# Altium schematic sheet Final Schematic.SchDoc
size A4; SheetNumber: 1; SheetTotal: 1
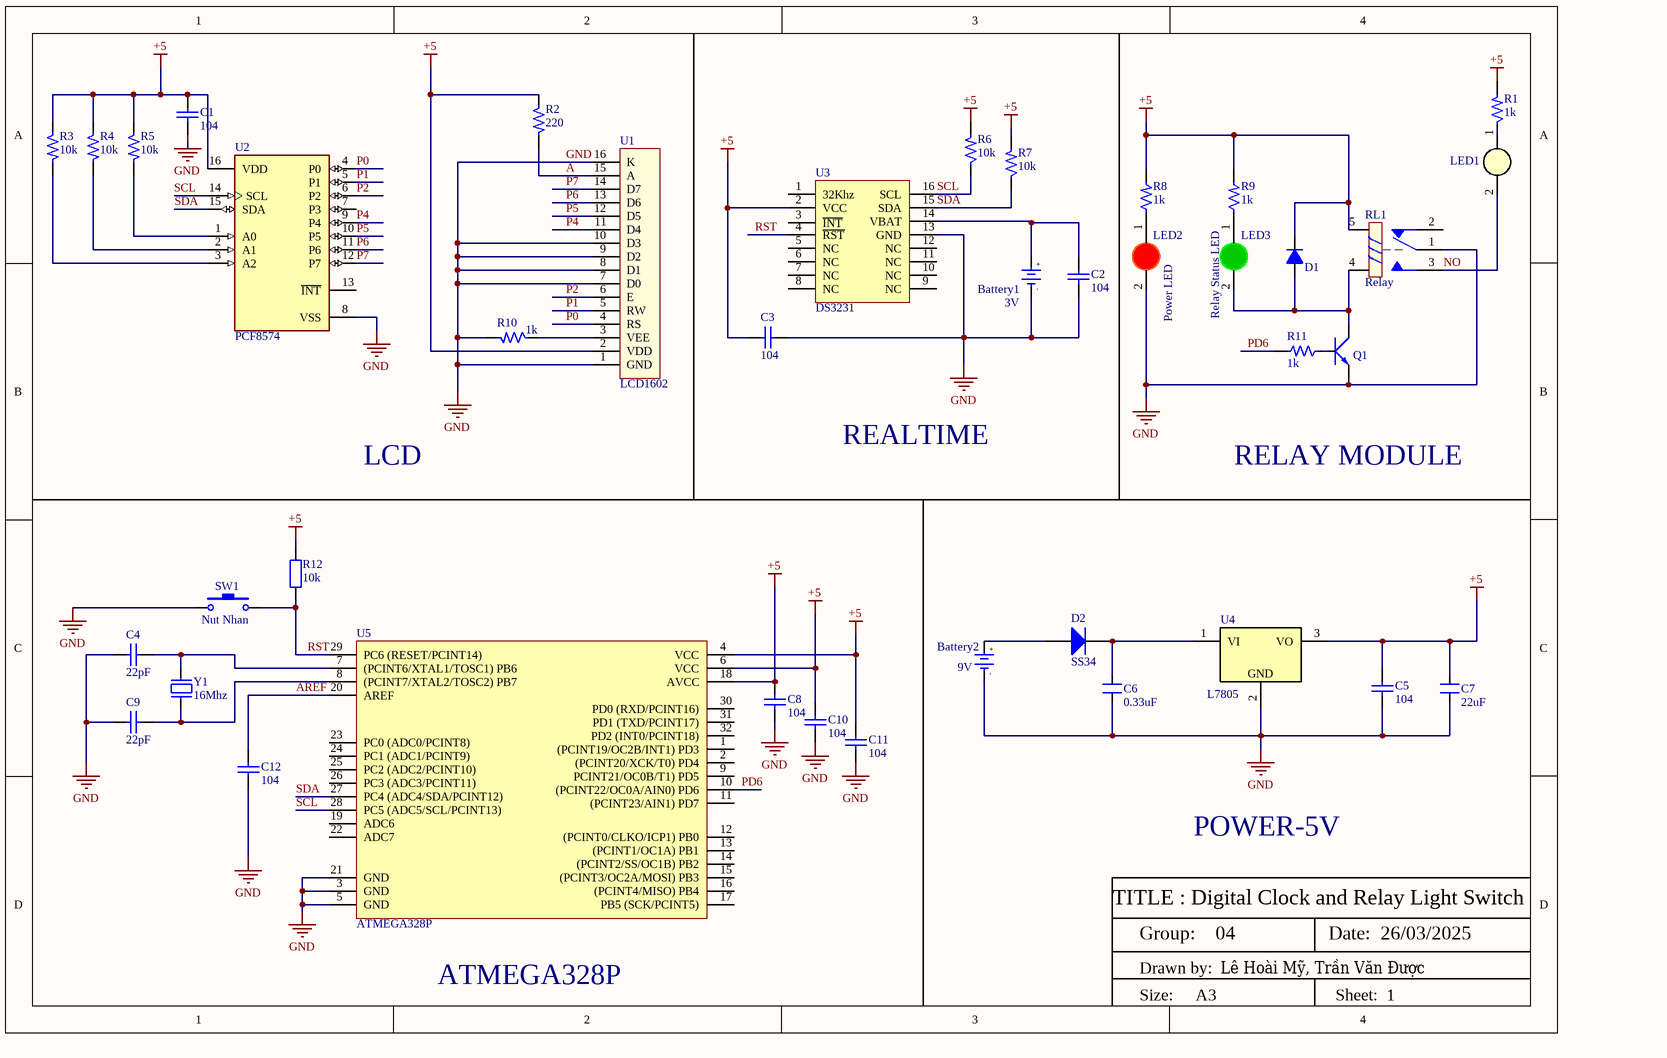
[diagram p0: Final Schematic.SchDoc]

## Parts
Battery1  3V  [PIN 3.6V 20mAh 3/V20H]
Battery2  9V  [De Pin 9V]
C1  104  [tu gom]
C2  104  [tu gom]
C3  104  [tu gom]
C4  22pF  [tu gom]
C5  104  [tu gom]
C6  0.33uF  [CN1]
C7  22uF  [CN1]
C8  104  [tu gom]
C9  22pF  [tu gom]
C10  104  [tu gom]
C11  104  [tu gom]
C12  104  [tu gom]
D1  100v  [DIODE 1A]  (value not drawn)
D2  SS34  [DIODE SMA]
LED1  LED 3mm  [LED-3MM-WHITE]  (value not drawn)
LED2  Power LED  [LED-3MM-RED]
LED3  Relay Status LED  [LED-3MM-GREEN]
Q1  ?  [TO92]  (value not drawn)
R1  1k  [R1/4W]
R2  220  [R1/4W]
R3  10k  [R1/4W]
R4  10k  [R1/4W]
R5  10k  [R1/4W]
R6  10k  [R1/4W]
R7  10k  [R1/4W]
R8  1k  [R1/4W]
R9  1k  [R1/4W]
R10  1k  [R1/4W]
R11  1k  [R1/4W]
R12  10k  [tro vach 1/4w]
RL1  Relay  [Relay 5 Chan SRD]
SW1  Nut Nhan  [Nut Nhan 2 Chan SMD 3x6x2.5]
U1  LCD1602  [LCD1602 with Jump]
U2  PCF8574  [FP-SOT162-1-MFG]
U3  DS3231  [SOIC 16]
U4  L7805  [DPAK_118_446_112X59_SMD]
U5  ATMEGA328P  [TQFP-32]
Y1  16Mhz  [Thach Anh 2 chan SMD]

## Nets
+5: C1.2 C3.2 C5.1 C7.2 C8.2 C10.2 C11.2 D1.2(K) R1.2 R2.1 R3.1 R4.1 R5.1 R6.2 R7.2 R8.2 R9.2 R12.2 RL1.5 U1.2(VDD) U2.16(VDD) U3.2(VCC) U4.3(VO) U5.4(VCC) U5.6(VCC) U5.18(AVCC)
GND: Battery1.2(GND) Battery2.2(GND) C1.1 C2.1 C3.1 C4.2 C5.2 C6.1 C7.1 C8.1 C9.1 C10.1 C11.1 C12.1 LED2.2(K) Q1.1(E) R10.2 RL1.1 SW1.1 U1.1(GND) U1.7(D0) U1.8(D1) U1.9(D2) U1.10(D3) U1.16(K) U2.8(VSS) U3.13(GND) U4.2 U5.3(GND) U5.5(GND) U5.21(GND)
A: R2.2 U1.15(A)
AREF: C12.2 U5.20(AREF)
NO: LED1.2(K) RL1.3
P0: U1.4(RS) U2.4(P0)
P1: U1.5(RW) U2.5(P1)
P2: U1.6(E) U2.6(P2)
P4: U1.11(D4) U2.9(P4)
P5: U1.12(D5) U2.10(P5)
P6: U1.13(D6) U2.11(P6)
P7: U1.14(D7) U2.12(P7)
PD6: R11.2 U5.10((PCINT22/OC0A/AIN0)_PD6)
RST: R12.1 SW1.2 U3.4(~{RST}) U5.29(PC6_(RESET/PCINT14))
SCL: R6.1 U2.14(SCL) U3.16(SCL) U5.28(PC5_(ADC5/SCL/PCINT13))
SDA: R7.1 U2.15(SDA) U3.15(SDA) U5.27(PC4_(ADC4/SDA/PCINT12))
NetBattery1_1: Battery1.1(+3V) C2.2 U3.14(VBAT)
NetBattery2_1: Battery2.1(+3V) D2.1(A)
NetC4_1: C4.1 U5.7((PCINT6/XTAL1/TOSC1)_PB6) Y1.2
NetC6_2: C6.2 D2.2(K) U4.1(VI)
NetC9_2: C9.2 U5.8((PCINT7/XTAL2/TOSC2)_PB7) Y1.1
NetD1_1: D1.1(A) LED3.2(K) Q1.3(C) RL1.4
NetLED1_1: LED1.1(A) R1.1
NetLED2_1: LED2.1(A) R8.1
NetLED3_1: LED3.1(A) R9.1
NetQ1_2: Q1.2(B) R11.1
NetR3_2: R3.2 U2.3(A2)
NetR4_2: R4.2 U2.2(A1)
NetR5_2: R5.2 U2.1(A0)
NetR10_1: R10.1 U1.3(VEE)

Not connected (* = marked no-connect by the designer): RL1 2; U2 7(P3) 13(~{INT}); U3 1(32Khz) 3(~{INT}) 5(NC) 6(NC) 7(NC) 8(NC) 9(NC) 10(NC) 11(NC) 12(NC); U5 1((PCINT19/OC2B/INT1)_PD3) 2((PCINT20/XCK/T0)_PD4) 9(PCINT21/OC0B/T1)_PD5) 11((PCINT23/AIN1)_PD7) 12((PCINT0/CLKO/ICP1)_PB0) 13((PCINT1/OC1A)_PB1) 14((PCINT2/SS/OC1B)_PB2) 15((PCINT3/OC2A/MOSI)_PB3) 16((PCINT4/MISO)_PB4) 17(PB5_(SCK/PCINT5)) 19(ADC6) 22(ADC7) 23(PC0_(ADC0/PCINT8)) 24(PC1_(ADC1/PCINT9)) 25(PC2_(ADC2/PCINT10)) 26(PC3_(ADC3/PCINT11)) 30(PD0_(RXD/PCINT16)) 31(PD1_(TXD/PCINT17)) 32(PD2_(INT0/PCINT18))

## Notes on the sheet
- REALTIME
- LCD
- RELAY MODULE
- POWER-5V
- TITLE : Digital Clock and Relay Light Switch
- ATMEGA328P
- Group:    04
- Drawn by:
- Lê Hoài Mỹ, Trần Văn Được
- Date:  26/03/2025
- Size:     A3
- Sheet:  1
- (in symbol De pin 9V cam) +; -
- (in symbol PIN 3V) +; -
- (in symbol REG_35V_5V-1.5A-7.5W-DPAK) GND

## Library data of the parts
Battery1 = PIN 3V: Battery 3VDC , NI-MH 3.6V 20mAh 3/V20H; Value: PIN 3V
Battery2 = De pin 9V cam: De Pin 9V; Ten: Hộp Đế Pin 9V Thường; Ma_Hang: MH002680
C1-C3 C5 C10 C12 = Tu gom 104 50V: Cắm; So_Chan: 2; Ten_Linh_Kien: Tụ gốm 104 100nF 50V; Don_Vi: Con; Ma_Hang: MH004761; Chung_Loai: Cắm; Kieu_Chan: *
C4 C9 = Tu gom 22pF 50V: Cắm; Don_Vi: Con; So_Chan: 2; Ten_Linh_Kien: Tụ gốm 22P 50V; Ma_Hang: MH004771; Chung_Loai: Cắm; Kieu_Chan: *
C6 C7 = CAP gom
C8 C11 = Tu gom 104 50V: Cắm; Don_Vi: Con; So_Chan: 2; Ten_Linh_Kien: Tụ gốm 104 100nF 50V; Ma_Hang: MH004761; Chung_Loai: Cắm; Kieu_Chan: *
D1 = Diode 1N4007: Cắm; Ten_Linh_Kien: Diode 1N4007 1A (DIP); Don_Vi: Con; Ma_Hang: MH001063; Ghi Chu: *; Kieu_Chan: *; Chung_Loai: Cắm
D2 = Diode SS34 ( 1N5822 ): Dán; Don_Vi: Con; Ma_Hang: MH002104; Ten_Linh_Kien: Diode SS34 3A 40V SMA ( 1N5822 SS34A); Kieu_Chan: *; Chung_Loai: Dán
LED1 = LED 3mm Trang: Cắm; Don_Vi: Con; Ma_Hang: MH009001; Ten_Linh_Kien: LED 3MM Trắng SS (1000c); Ghi_Chu: *; Kieu_Chan: *; Chung_Loai: Cắm
LED2 = LED 3mm Do: Cắm; Don_Vi: Con; Ma_Hang: MH003892; Ten_Linh_Kien: Led 3MM Phủ Đỏ (10c); Ghi_Chu: *; Kieu_Chan: *; Chung_Loai: Cắm
LED3 = LED 3mm Xanh La: Cắm; Don_Vi: Con; Ma_Hang: MH001054; Ten_Linh_Kien: Led 3MM Phủ Xanh (10c); Ghi_Chu: *; Kieu_Chan: *; Chung_Loai: Cắm
Q1 = Trans 2N3904: NPN transistor EBC; Value: C9014
R1-R11 = Res
R12 = Tro Vach 1/4W 5% 10k: Căm; Chung_Loai: Cắm; Don_Vi: Con; So_Chan: 2; Ten_Linh_Kien: Trở Vạch 1/4w 5% 10K; Ma_Hang: MH007354; Kieu_Chan: *
RL1 = Relay 5 Chan SRD: Relay 5 Chan; Ma_Hang: MH009374; Ten: Relay 5V10A SRD-05VDC-SL-C Chính Hãng
SW1 = Nut Nhan 2 Chan SMD 3x6x2.5: Ma_Hang: MH001036; Ten: Nút Nhấn 2 Chân 3x6x2.5MM SMD
U1 = LCD1602 XL: LCD 1602 Xanh Lá; Ten: Màn hình LCD 1602 Xanh Lá; Ma_Hang: 67HZ; NCC: NSHOP; CHIP: HD44780
U2 = CMP-10112-000010-1: IC I/O EXPANDER I2C 8B 16SOIC; Manufacturer Part Number: PCF8574T/3,518; Manufacturer: NXP Semiconductors; Frequency: 100kHz; Max Supply Voltage: 6V; Standoff Height: 0.1mm; Nominal Supply Current: 40uA; Max Junction Temp: +125°C; Min Supply Voltage: 2.5V; Number Of I/Os: 8; Footprint Url: https://www.nxp.com/docs/en/package-information/SOT162-1.pdf; ComponentLink2URL: https://www.nxp.com/docs/en/data-sheet/PCF8574_PCF8574A.pdf; Automotive: No; Digikey Description: IC I/O EXPANDER I2C 8B 16SOIC; Mouser Description: PCF8574 Series 2.5 - 6V Remote 8-bit I/O Expander for I2C-bus - SOIC-16; Ipc Land Pattern Name: SOIC127P1032X265-16; Interface: I2C; Octopart: https://octopart.com/pcf8574t%2F3%2C518-nxp+semiconductors-10470852; Ambient Temperature Range Low: -40°C; Lead Free: Yes; Device Class L2: Interface ICs; Temperature Range High: +85°C; Device Class L1: Integrated Circuits (ICs); Package: SOT162-1; ComponentLink2Description: Datasheet; Device Class L3: I/O Expanders; Temperature: -40°C to +85°C; Ambient Temperature Range High: +85°C; Height: 2.65mm; Category: IC; RoHS: TRUE; Temperature Range Low: -40°C
U3 = DS3231 SMD: SOIC
U4 = REG_35V_5V-1.5A-7.5W-DPAK: Linear Voltage Regulator IC 1 Output 1.5A DPAK; Manufacturer: Diodes; Manufacturer Part Number: L7805CDT-TR; Alternate Part Number-1: CJ7805 3%; Case/Package: DPAK; Supplier-1: SP ROAD; Supplier Part Number-1: L7805CDT-TR
U5 = IC_ATMEGA328P: AVR AVR® ATmega Microcontroller IC 8-Bit 20MHz 32KB (16K x 16) FLASH 32-TQFP (7x7); Manufacturer: Microchip Technology; Manufacturer Part Number: ATMEGA328P-AUR; Alternate Part Number-1: NA; Case/Package: 32-TQFP; Supplier-1: Arrow; Supplier Part Number-1: ATMEGA328P-AUR
Y1 = Thach Anh 2 chan SMD: Crystal For all Crystal 2pin.; Value: 4Mhz